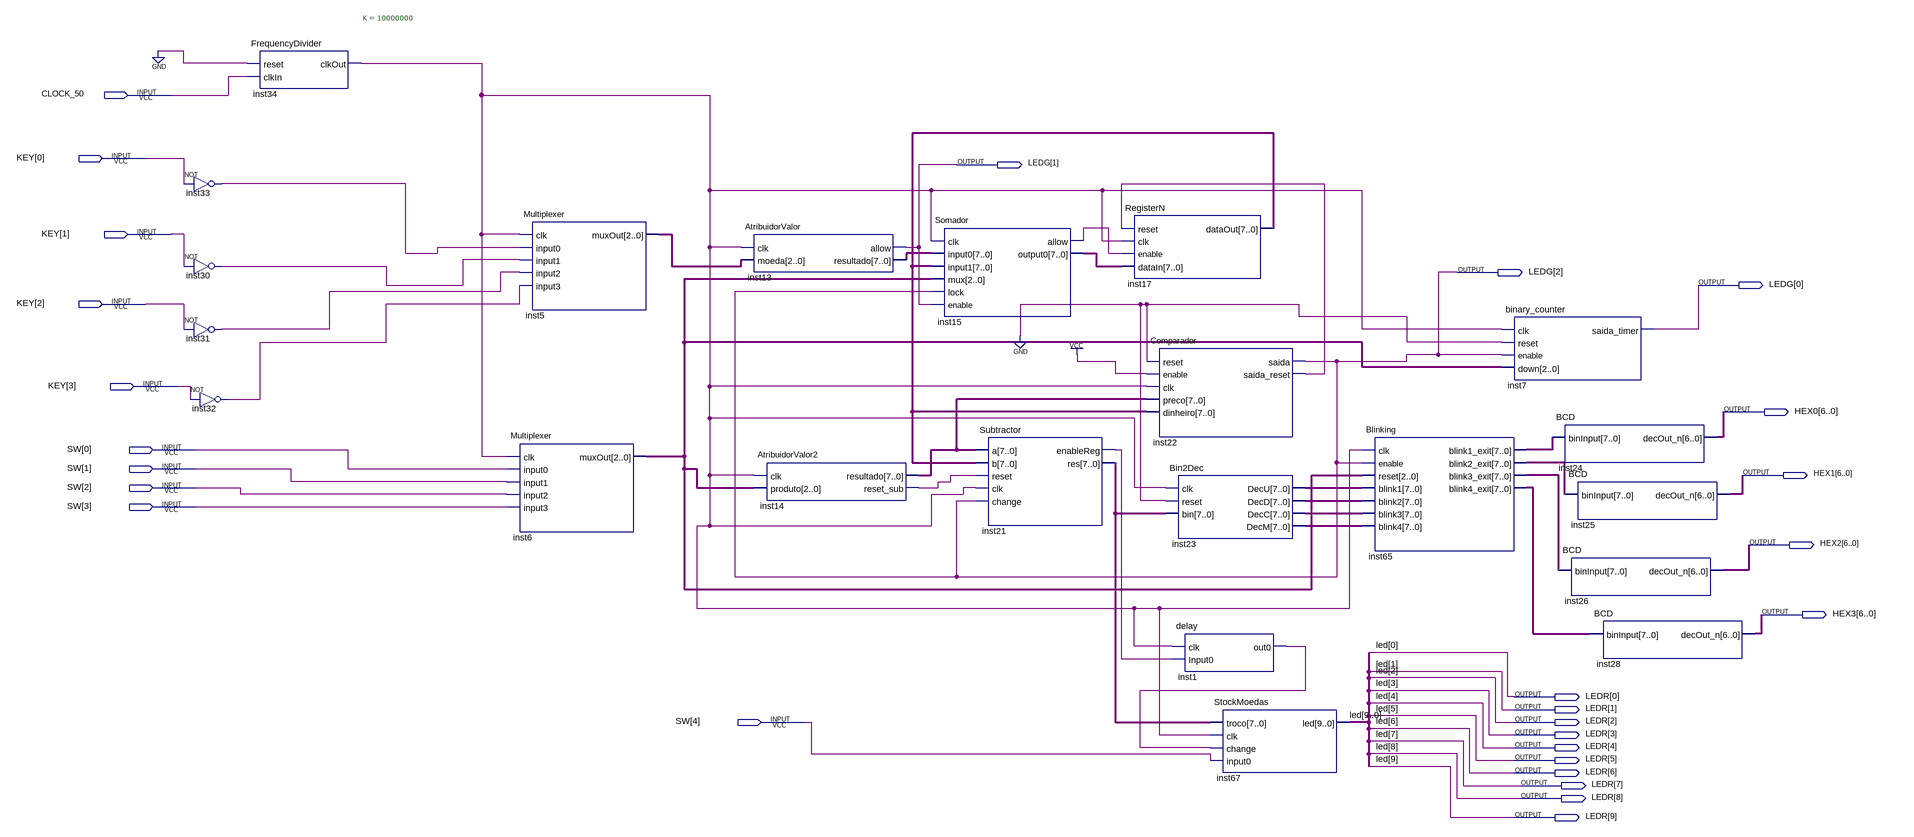
[diagram p0: schematic sheet]
// Quartus schematic maquinacafebdf.bdf as structural Verilog: 22 symbols, 27 pins
module maquinacafebdf (
  input  CLOCK_50,
  input  [3:0] KEY,
  input  [4:0] SW,
  output [2:0] LEDG,
  output [6:0] HEX0,
  output [6:0] HEX1,
  output [6:0] HEX2,
  output [6:0] HEX3,
  output [9:0] LEDR
);

  wire inst1_out0, inst14_reset_sub, inst15_allow, inst21_enablereg, inst22_saida_reset, inst30_out,
       inst31_out, inst32_out, inst33_out, inst34_clkout;
  wire [2:0] inst5_muxout, inst6_muxout;
  wire [7:0] inst13_resultado, inst14_resultado, inst15_output0, inst17_dataout, inst21_res, inst23_decc,
       inst23_decd, inst23_decm, inst23_decu, inst65_blink1_exit, inst65_blink2_exit, inst65_blink3_exit,
       inst65_blink4_exit;

  not inst33 (inst33_out, KEY[0]);
  not inst30 (inst30_out, KEY[1]);
  not inst31 (inst31_out, KEY[2]);
  not inst32 (inst32_out, KEY[3]);
  FrequencyDivider #(.K(10000000)) inst34 (.reset(1'b0), .clkIn(CLOCK_50), .clkOut(inst34_clkout));
  Multiplexer inst5 (
    .clk(inst34_clkout), .input0(inst33_out), .input1(inst30_out), .input2(inst31_out), .input3(inst32_out),
    .muxOut(inst5_muxout));
  Multiplexer inst6 (
    .clk(inst34_clkout), .input0(SW[0]), .input1(SW[1]), .input2(SW[2]), .input3(SW[3]), .muxOut(inst6_muxout));
  AtribuidorValor inst13 (.clk(inst34_clkout), .moeda(inst5_muxout), .allow(LEDG[1]), .resultado(inst13_resultado));
  AtribuidorValor2 inst14 (
    .clk(inst34_clkout), .produto(inst6_muxout), .resultado(inst14_resultado), .reset_sub(inst14_reset_sub));
  Somador inst15 (
    .clk(inst34_clkout), .input0(inst13_resultado), .input1(inst17_dataout), .mux(inst6_muxout),
    .lock(LEDG[2]), .enable(LEDG[1]), .allow(inst15_allow), .output0(inst15_output0));
  Subtractor inst21 (
    .a(inst14_resultado), .b(inst17_dataout), .reset(inst14_reset_sub), .clk(inst34_clkout),
    .change(LEDG[2]), .enableReg(inst21_enablereg), .res(inst21_res));
  RegisterN inst17 (
    .reset(inst22_saida_reset), .clk(inst34_clkout), .enable(inst15_allow), .dataIn(inst15_output0),
    .dataOut(inst17_dataout));
  Comparador inst22 (
    .reset(1'b0), .enable(1'b1), .clk(inst34_clkout), .preco(inst14_resultado), .dinheiro(inst17_dataout),
    .saida(LEDG[2]), .saida_reset(inst22_saida_reset));
  Bin2Dec inst23 (
    .clk(inst34_clkout), .reset(1'b0), .bin(inst21_res), .DecU(inst23_decu), .DecD(inst23_decd),
    .DecC(inst23_decc), .DecM(inst23_decm));
  delay inst1 (.clk(inst34_clkout), .Input0(inst21_enablereg), .out0(inst1_out0));
  StockMoedas inst67 (.troco(inst21_res), .clk(inst34_clkout), .change(inst1_out0), .input0(SW[4]), .led(LEDR));
  Blinking inst65 (
    .clk(inst34_clkout), .enable(LEDG[2]), .reset(inst6_muxout), .blink1(inst23_decu), .blink2(inst23_decd),
    .blink3(inst23_decc), .blink4(inst23_decm), .blink1_exit(inst65_blink1_exit),
    .blink2_exit(inst65_blink2_exit), .blink3_exit(inst65_blink3_exit), .blink4_exit(inst65_blink4_exit));
  binary_counter inst7 (
    .clk(inst34_clkout), .reset(1'b0), .enable(LEDG[2]), .down(inst6_muxout), .saida_timer(LEDG[0]));
  BCD inst24 (.binInput(inst65_blink1_exit), .decOut_n(HEX0));
  BCD inst25 (.binInput(inst65_blink2_exit), .decOut_n(HEX1));
  BCD inst26 (.binInput(inst65_blink3_exit), .decOut_n(HEX2));
  BCD inst28 (.binInput(inst65_blink4_exit), .decOut_n(HEX3));

  // Other names for the same wires on the sheet: led[9:0] = LEDR
endmodule
